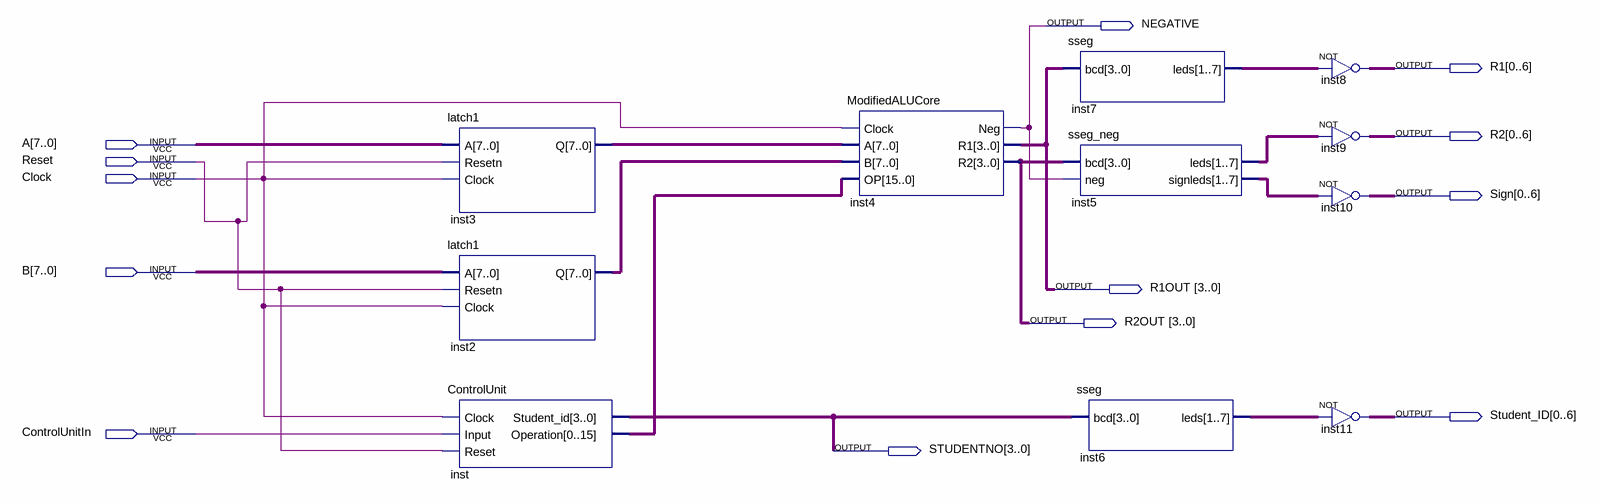
[diagram p0: schematic sheet]
// Quartus schematic ModifiedALU.bdf as structural Verilog: 11 symbols, 13 pins
module ModifiedALU (
  input  [7:0] A,
  input  Reset,
  input  Clock,
  input  [7:0] B,
  input  ControlUnitIn,
  output NEGATIVE,
  output [0:6] R1,
  output [0:6] R2,
  output [0:6] Sign,
  output [3:0] R1OUT,
  output [3:0] R2OUT,
  output [0:6] Student_ID,
  output [3:0] STUDENTNO
);

  wire [6:0] inst5_leds, inst5_signleds, inst6_leds, inst7_leds;
  wire [7:0] inst2_q, inst3_q;
  wire [15:0] inst_operation;

  latch1 inst3 (.A(A), .Resetn(Reset), .Clock(Clock), .Q(inst3_q));
  latch1 inst2 (.A(B), .Resetn(Reset), .Clock(Clock), .Q(inst2_q));
  ControlUnit inst (
    .Clock(Clock), .Input(ControlUnitIn), .Reset(Reset), .Student_id(STUDENTNO), .Operation(inst_operation));
  ModifiedALUCore inst4 (
    .Clock(Clock), .A(inst3_q), .B(inst2_q), .OP(inst_operation), .Neg(NEGATIVE), .R1(R1OUT), .R2(R2OUT));
  sseg inst7 (.bcd(R1OUT), .leds(inst7_leds));
  sseg_neg inst5 (.bcd(R2OUT), .neg(NEGATIVE), .leds(inst5_leds), .signleds(inst5_signleds));
  sseg inst6 (.bcd(STUDENTNO), .leds(inst6_leds));
  assign R1 = ~inst7_leds;  // NOT inst8, 7 bits wide
  assign R2 = ~inst5_leds;  // NOT inst9, 7 bits wide
  assign Sign = ~inst5_signleds;  // NOT inst10, 7 bits wide
  assign Student_ID = ~inst6_leds;  // NOT inst11, 7 bits wide
endmodule
